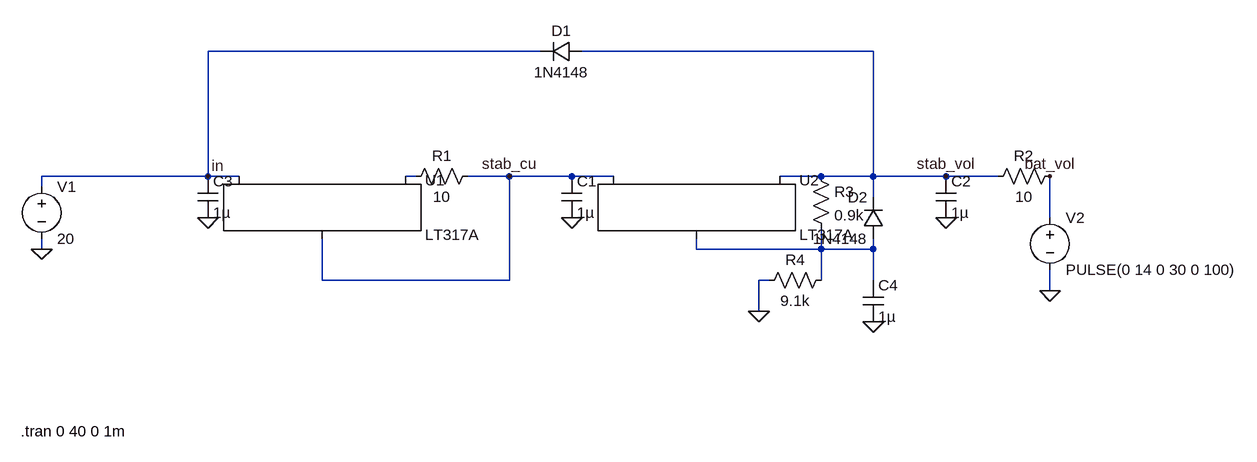
[diagram p0: schematic akkutolto.asc]
akkutolto.asc, the LTspice schematic file:
Version 4
SHEET 1 1288 680
WIRE -160 -464 -672 -464
WIRE 352 -464 -96 -464
WIRE -672 -272 -672 -464
WIRE -672 -272 -928 -272
WIRE -624 -272 -672 -272
WIRE -352 -272 -368 -272
WIRE -208 -272 -272 -272
WIRE -112 -272 -208 -272
WIRE -48 -272 -112 -272
WIRE 272 -272 208 -272
WIRE 352 -272 352 -464
WIRE 352 -272 272 -272
WIRE 464 -272 352 -272
WIRE 544 -272 464 -272
WIRE -928 -256 -928 -272
WIRE -672 -256 -672 -272
WIRE 352 -240 352 -272
WIRE 624 -208 624 -272
WIRE -928 -160 -928 -176
WIRE 80 -160 80 -176
WIRE 272 -160 272 -192
WIRE 272 -160 80 -160
WIRE 352 -160 352 -176
WIRE 352 -160 272 -160
WIRE -496 -112 -496 -176
WIRE -208 -112 -208 -272
WIRE -208 -112 -496 -112
WIRE 192 -112 176 -112
WIRE 272 -112 272 -160
WIRE 352 -112 352 -160
WIRE 624 -96 624 -128
WIRE 176 -64 176 -112
FLAG 624 -96 0
FLAG -928 -160 0
FLAG -672 -208 0
FLAG -112 -208 0
FLAG 464 -208 0
FLAG -208 -272 stab_cu
FLAG 464 -272 stab_vol
FLAG -672 -272 in
FLAG 624 -272 bat_vol
FLAG 176 -64 0
FLAG 352 -48 0
SYMBOL res -256 -288 R90
WINDOW 0 0 56 VBottom 2
WINDOW 3 32 56 VTop 2
SYMATTR InstName R1
SYMATTR Value 10
SYMBOL cap -128 -272 R0
SYMATTR InstName C1
SYMATTR Value 1µ
SYMBOL cap 448 -272 R0
SYMATTR InstName C2
SYMATTR Value 1µ
SYMBOL cap -688 -272 R0
SYMATTR InstName C3
SYMATTR Value 1µ
SYMBOL voltage -928 -272 R0
WINDOW 123 0 0 Left 0
WINDOW 39 0 0 Left 0
SYMATTR InstName V1
SYMATTR Value 20
SYMBOL voltage 624 -224 R0
WINDOW 123 0 0 Left 0
WINDOW 39 0 0 Left 0
SYMATTR InstName V2
SYMATTR Value PULSE(0 14 0 30 0 100)
SYMBOL res 640 -288 R90
WINDOW 0 0 56 VBottom 2
WINDOW 3 32 56 VTop 2
SYMATTR InstName R2
SYMATTR Value 10
SYMBOL PowerProducts\\LT317A -496 -272 R0
SYMATTR InstName U1
SYMBOL PowerProducts\\LT317A 80 -272 R0
SYMATTR InstName U2
SYMBOL res 256 -288 R0
SYMATTR InstName R3
SYMATTR Value 0.9k
SYMBOL res 288 -128 R90
WINDOW 0 0 56 VBottom 2
WINDOW 3 32 56 VTop 2
SYMATTR InstName R4
SYMATTR Value 9.1k
SYMBOL cap 336 -112 R0
SYMATTR InstName C4
SYMATTR Value 1µ
SYMBOL diode -96 -480 R90
WINDOW 0 0 32 VBottom 2
WINDOW 3 32 32 VTop 2
SYMATTR InstName D1
SYMATTR Value 1N4148
SYMBOL diode 368 -176 R180
WINDOW 0 24 64 Left 2
WINDOW 3 24 0 Left 2
SYMATTR InstName D2
SYMATTR Value 1N4148
TEXT -960 120 Left 2 !.tran 0 40 0 1m

The netlist it stands for:
* akkutolto.asc
R1 stab_cu N001 10
C1 stab_cu 0 1µ
C2 stab_vol 0 1µ
C3 in 0 1µ
V1 in 0 20
V2 bat_vol 0 PULSE(0 14 0 30 0 100)
R2 bat_vol stab_vol 10
XU1 stab_cu N001 in LT317A
XU2 N002 stab_vol stab_cu LT317A
R3 stab_vol N002 0.9k
R4 N002 0 9.1k
C4 N002 0 1µ
D1 stab_vol in 1N4148
D2 N002 stab_vol 1N4148
.model D D
.lib standard.dio
.tran 0 40 0 1m
.lib LTC.lib
.backanno
.end